# EAGLE schematic watson (EAGLE 6.5.0)
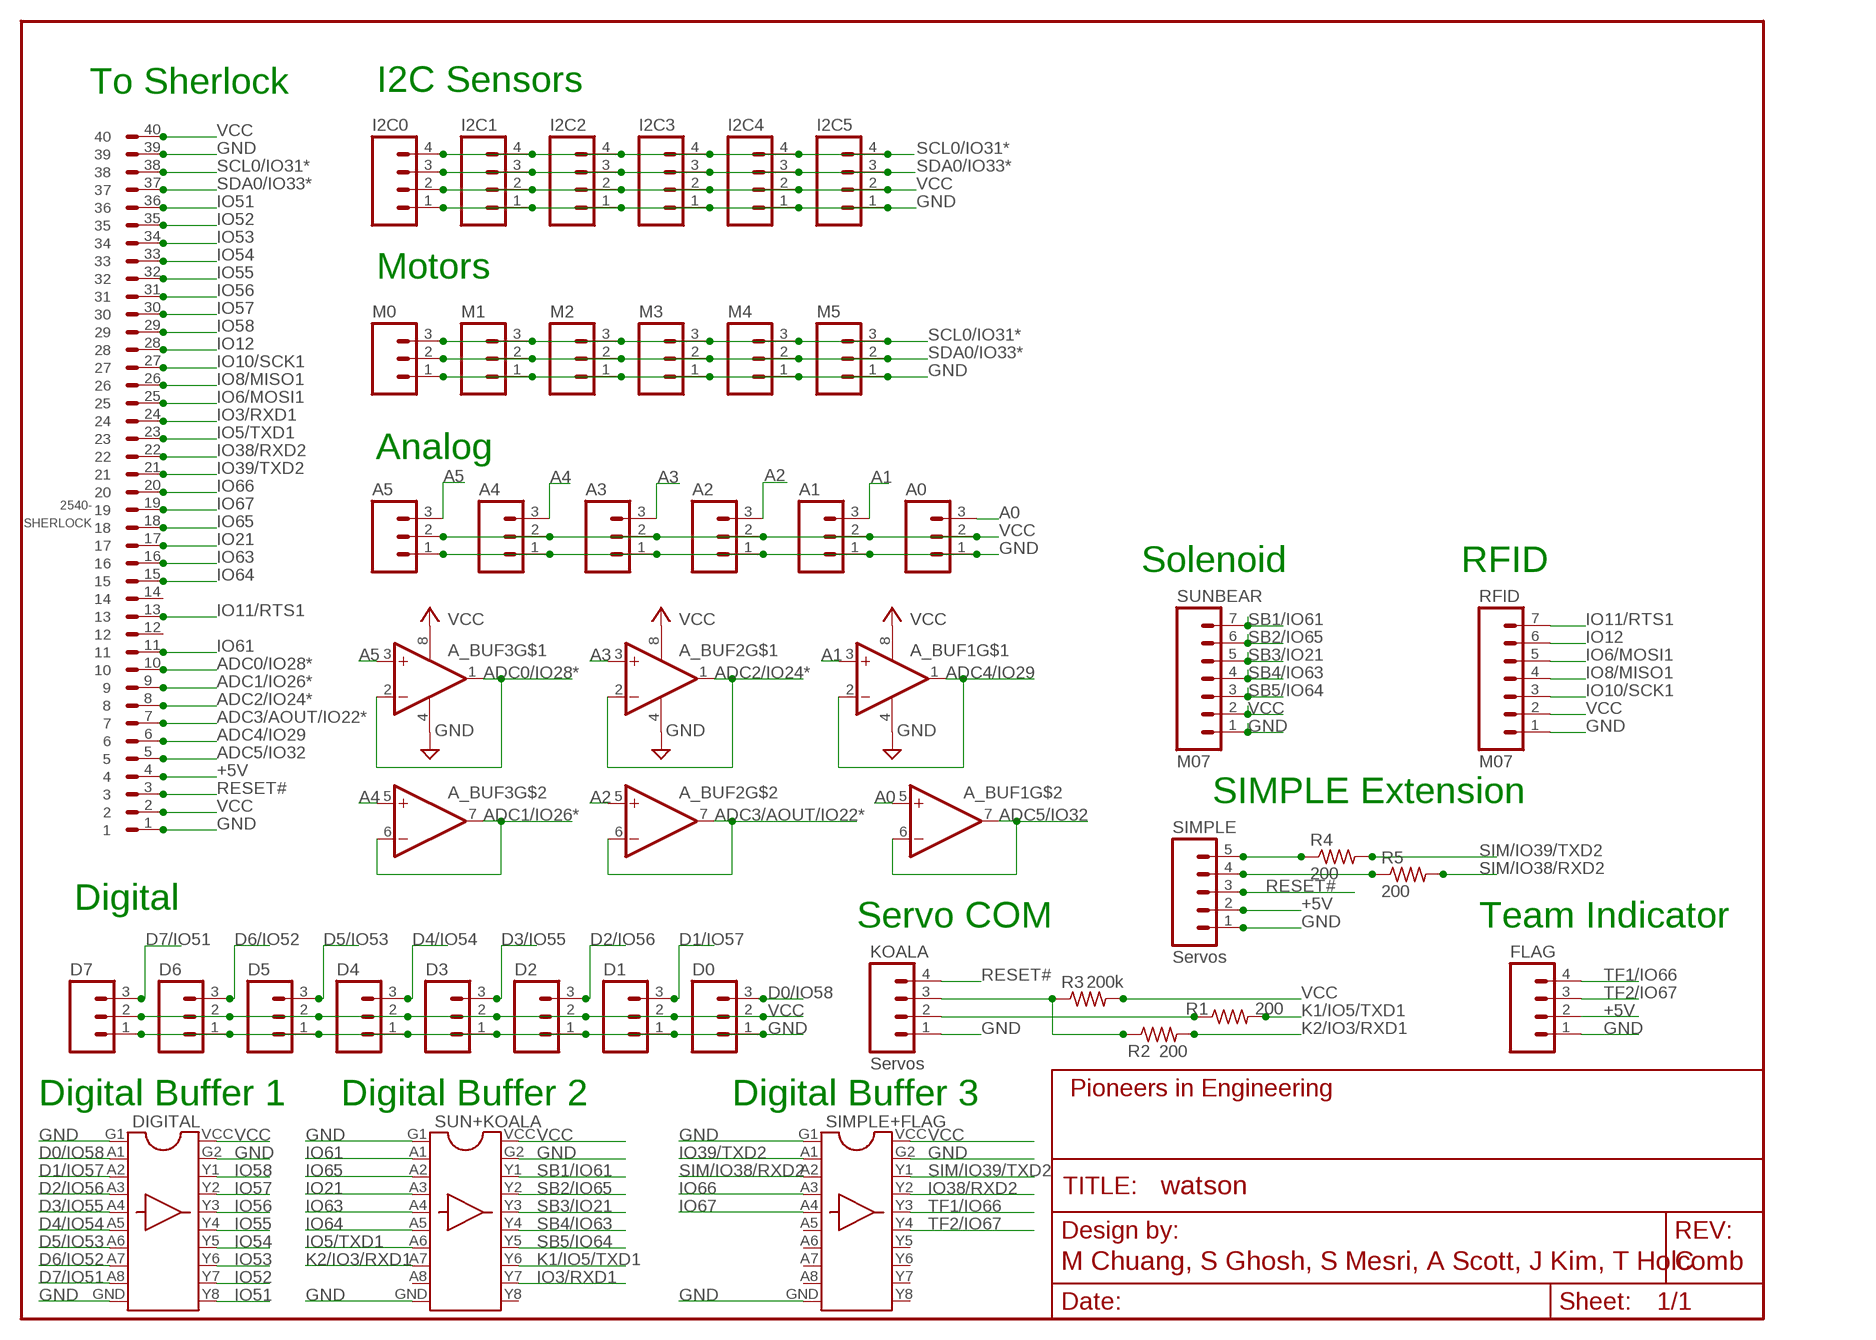
[diagram p0: schematic, sheet 1]
FRAME1 (FRAME-LETTER): AUTHOR: M Chuang, S Ghosh, S Mesri, A Scott, J Kim, T Holcomb; REVISION: C

## Parts
A0  M031X03-MTA  [1X03-MTA]
A1  M031X03-MTA  [1X03-MTA]
A2  M031X03-MTA  [1X03-MTA]
A3  M031X03-MTA  [1X03-MTA]
A4  M031X03-MTA  [1X03-MTA]
A5  M031X03-MTA  [1X03-MTA]
A_BUF1  OPAMP_DUALSOCKET  [OPAMP_DUAL_DIL]
A_BUF2  OPAMP_DUALSOCKET  [OPAMP_DUAL_DIL]
A_BUF3  OPAMP_DUALSOCKET  [OPAMP_DUAL_DIL]
D0  M031X03-MTA  [1X03-MTA]
D1  M031X03-MTA  [1X03-MTA]
D2  M031X03-MTA  [1X03-MTA]
D3  M031X03-MTA  [1X03-MTA]
D4  M031X03-MTA  [1X03-MTA]
D5  M031X03-MTA  [1X03-MTA]
D6  M031X03-MTA  [1X03-MTA]
D7  M031X03-MTA  [1X03-MTA]
DIGITAL  DIGITAL_BUFFERSOCKET  [DIGITAL_BUFFER_SOCKET]
FLAG  M041X04-MTA  [1X04-MTA]
I2C0  M041X04-MTA  [1X04-MTA]
I2C1  M041X04-MTA  [1X04-MTA]
I2C2  M041X04-MTA  [1X04-MTA]
I2C3  M041X04-MTA  [1X04-MTA]
I2C4  M041X04-MTA  [1X04-MTA]
I2C5  M041X04-MTA  [1X04-MTA]
KOALA  Servos  M041X04-MTA  [1X04-MTA]
M0  M031X03-MTA  [1X03-MTA]
M1  M031X03-MTA  [1X03-MTA]
M2  M031X03-MTA  [1X03-MTA]
M3  M031X03-MTA  [1X03-MTA]
M4  M031X03-MTA  [1X03-MTA]
M5  M031X03-MTA  [1X03-MTA]
R1  200  R-US_R0603  [R0603]
R2  200  R-US_R0603  [R0603]
R3  200k  R-US_R0603  [R0603]
R4  200  R-US_R0603  [R0603]
R5  200  R-US_R0603  [R0603]
RFID  M07  [1X07-MTA]
SHERLOCK  2540-  [PAK100/2500-40]
SIMPLE  Servos  M05MTA  [1X05-MTA]
SIMPLE+FLAG  DIGITAL_BUFFERSOCKET  [DIGITAL_BUFFER_SOCKET]
SUN+KOALA  DIGITAL_BUFFERSOCKET  [DIGITAL_BUFFER_SOCKET]
SUNBEAR  M07  [1X07-MTA]

## Nets
+5V: FLAG.2 SHERLOCK.4 SIMPLE.2
A0: A0.3 A_BUF1.5(+IN)
A1: A1.3 A_BUF1.3(+IN)
A2: A2.3 A_BUF2.5(+IN)
A3: A3.3 A_BUF2.3(+IN)
A4: A4.3 A_BUF3.5(+IN)
A5: A5.3 A_BUF3.3(+IN)
ADC0/IO28*: A_BUF3.1(OUT) A_BUF3.2(-IN) SHERLOCK.10
ADC1/IO26*: A_BUF3.6(-IN) A_BUF3.7(OUT) SHERLOCK.9
ADC2/IO24*: A_BUF2.1(OUT) A_BUF2.2(-IN) SHERLOCK.8
ADC3/AOUT/IO22*: A_BUF2.6(-IN) A_BUF2.7(OUT) SHERLOCK.7
ADC4/IO29: A_BUF1.1(OUT) A_BUF1.2(-IN) SHERLOCK.6
ADC5/IO32: A_BUF1.6(-IN) A_BUF1.7(OUT) SHERLOCK.5
D0/IO58: D0.3 DIGITAL.A1
D1/IO57: D1.3 DIGITAL.A2
D2/IO56: D2.3 DIGITAL.A3
D3/IO55: D3.3 DIGITAL.A4
D4/IO54: D4.3 DIGITAL.A5
D5/IO53: D5.3 DIGITAL.A6
D6/IO52: D6.3 DIGITAL.A7
D7/IO51: D7.3 DIGITAL.A8
GND: A0.1 A1.1 A2.1 A3.1 A4.1 A5.1 A_BUF1.4(V-) A_BUF2.4(V-) A_BUF3.4(V-) D0.1 D1.1 D2.1 D3.1 D4.1 D5.1 D6.1 D7.1 DIGITAL.G1 DIGITAL.G2 DIGITAL.GND FLAG.1 I2C0.1 I2C1.1 I2C2.1 I2C3.1 I2C4.1 I2C5.1 KOALA.1 M0.1 M1.1 M2.1 M3.1 M4.1 M5.1 RFID.1 SHERLOCK.1 SHERLOCK.39 SIMPLE+FLAG.G1 SIMPLE+FLAG.G2 SIMPLE+FLAG.GND SIMPLE.1 SUN+KOALA.G1 SUN+KOALA.G2 SUN+KOALA.GND SUNBEAR.1
IO3/RXD1: SHERLOCK.24 SUN+KOALA.Y7
IO5/TXD1: SHERLOCK.23 SUN+KOALA.A6
IO6/MOSI1: RFID.5 SHERLOCK.25
IO8/MISO1: RFID.4 SHERLOCK.26
IO10/SCK1: RFID.3 SHERLOCK.27
IO11/RTS1: RFID.7 SHERLOCK.13
IO12: RFID.6 SHERLOCK.28
IO21: SHERLOCK.17 SUN+KOALA.A3
IO38/RXD2: SHERLOCK.22 SIMPLE+FLAG.Y2
IO39/TXD2: SHERLOCK.21 SIMPLE+FLAG.A1
IO51: DIGITAL.Y8 SHERLOCK.36
IO52: DIGITAL.Y7 SHERLOCK.35
IO53: DIGITAL.Y6 SHERLOCK.34
IO54: DIGITAL.Y5 SHERLOCK.33
IO55: DIGITAL.Y4 SHERLOCK.32
IO56: DIGITAL.Y3 SHERLOCK.31
IO57: DIGITAL.Y2 SHERLOCK.30
IO58: DIGITAL.Y1 SHERLOCK.29
IO61: SHERLOCK.11 SUN+KOALA.A1
IO63: SHERLOCK.16 SUN+KOALA.A4
IO64: SHERLOCK.15 SUN+KOALA.A5
IO65: SHERLOCK.18 SUN+KOALA.A2
IO66: SHERLOCK.20 SIMPLE+FLAG.A3
IO67: SHERLOCK.19 SIMPLE+FLAG.A4
K1/IO5/TXD1: R1.2 SUN+KOALA.Y6
K2/IO3/RXD1: R2.2 SUN+KOALA.A7
N$1: KOALA.3 R2.1 R3.1
N$2: KOALA.2 R1.1
N$5: R4.1 SIMPLE.5
N$6: R5.1 SIMPLE.4
RESET#: KOALA.4 SHERLOCK.3 SIMPLE.3
SB1/IO61: SUN+KOALA.Y1 SUNBEAR.7
SB2/IO65: SUN+KOALA.Y2 SUNBEAR.6
SB3/IO21: SUN+KOALA.Y3 SUNBEAR.5
SB4/IO63: SUN+KOALA.Y4 SUNBEAR.4
SB5/IO64: SUN+KOALA.Y5 SUNBEAR.3
SCL0/IO31*: I2C0.4 I2C1.4 I2C2.4 I2C3.4 I2C4.4 I2C5.4 M0.3 M1.3 M2.3 M3.3 M4.3 M5.3 SHERLOCK.38
SDA0/IO33*: I2C0.3 I2C1.3 I2C2.3 I2C3.3 I2C4.3 I2C5.3 M0.2 M1.2 M2.2 M3.2 M4.2 M5.2 SHERLOCK.37
SIM/IO38/RXD2: R5.2 SIMPLE+FLAG.A2
SIM/IO39/TXD2: R4.2 SIMPLE+FLAG.Y1
TF1/IO66: FLAG.4 SIMPLE+FLAG.Y3
TF2/IO67: FLAG.3 SIMPLE+FLAG.Y4
VCC: A0.2 A1.2 A2.2 A3.2 A4.2 A5.2 A_BUF1.8(V+) A_BUF2.8(V+) A_BUF3.8(V+) D0.2 D1.2 D2.2 D3.2 D4.2 D5.2 D6.2 D7.2 DIGITAL.VCC I2C0.2 I2C1.2 I2C2.2 I2C3.2 I2C4.2 I2C5.2 R3.2 RFID.2 SHERLOCK.2 SHERLOCK.40 SIMPLE+FLAG.VCC SUN+KOALA.VCC SUNBEAR.2
Unconnected: SHERLOCK.12 SHERLOCK.14 SIMPLE+FLAG.A5 SIMPLE+FLAG.A6 SIMPLE+FLAG.A7 SIMPLE+FLAG.A8 SIMPLE+FLAG.Y5 SIMPLE+FLAG.Y6 SIMPLE+FLAG.Y7 SIMPLE+FLAG.Y8 SUN+KOALA.A8 SUN+KOALA.Y8

## Notes on the sheet
- To Sherlock | I2C Sensors
- Motors
- Analog
- Solenoid | RFID
- SIMPLE Extension
- Digital
- Servo COM | Team Indicator
- Digital Buffer 1 | Digital Buffer 2 | Digital Buffer 3

## Library data of the parts
A0 A1-A5 D0 D1-D7 M0 M1-M5 = pie:M03: 3-pin 0.1-inch header and MTA connector; PARTNUMBER: A19470-ND
A_BUF1-A_BUF3 = pie:OPAMP_DUAL: Dual op amp with 1.8 to 6V operating range We are using this to buffer analog I/O pins from the Panda from peripherals on the Watson data sheet: http://ww1.microchip.com/downloads/en/devicedoc/21733j.pdf; PIE_DIGIKEY-PN: A100204-ND; PIE_MICROCHIP-PN: MCP6001
DIGITAL SIMPLE+FLAG SUN+KOALA = pie:DIGITAL_BUFFER: 8-bit, non-inverting, IC Buffer; PIE_DIGIKEY-PN: TC74HC541APF-ND
FLAG I2C0 I2C1-I2C5 KOALA = pie:M04: 4-pin 0.1-inch header and MTA connector; PARTNUMBER: A1922-ND
R1-R5 = pie:R-US_: RESISTOR, American symbol
RFID SUNBEAR = pie:M07: 7-pin 0.1-inch header and MTA connector; PARTNUMBER: A19472-ND
SHERLOCK = pie:2540-: 3M (TM) Pak 100 4-Wall Header Source: 3M; OC_FARNELL: unknown; OC_NEWARK: unknown; PARTNUMBER: S9175-ND
SIMPLE = pie:M05: 5-pin 0.1-inch header and MTA connector; PARTNUMBER: A19471-ND